# EasyEDA schematic SCH_HomeControl_2022-04-17.json
TITLE: Sheet_1; REV: 1.0; Date: 2022-04-16; Sheet: 1/1; Drawn By: Axfff; Company: Your Company
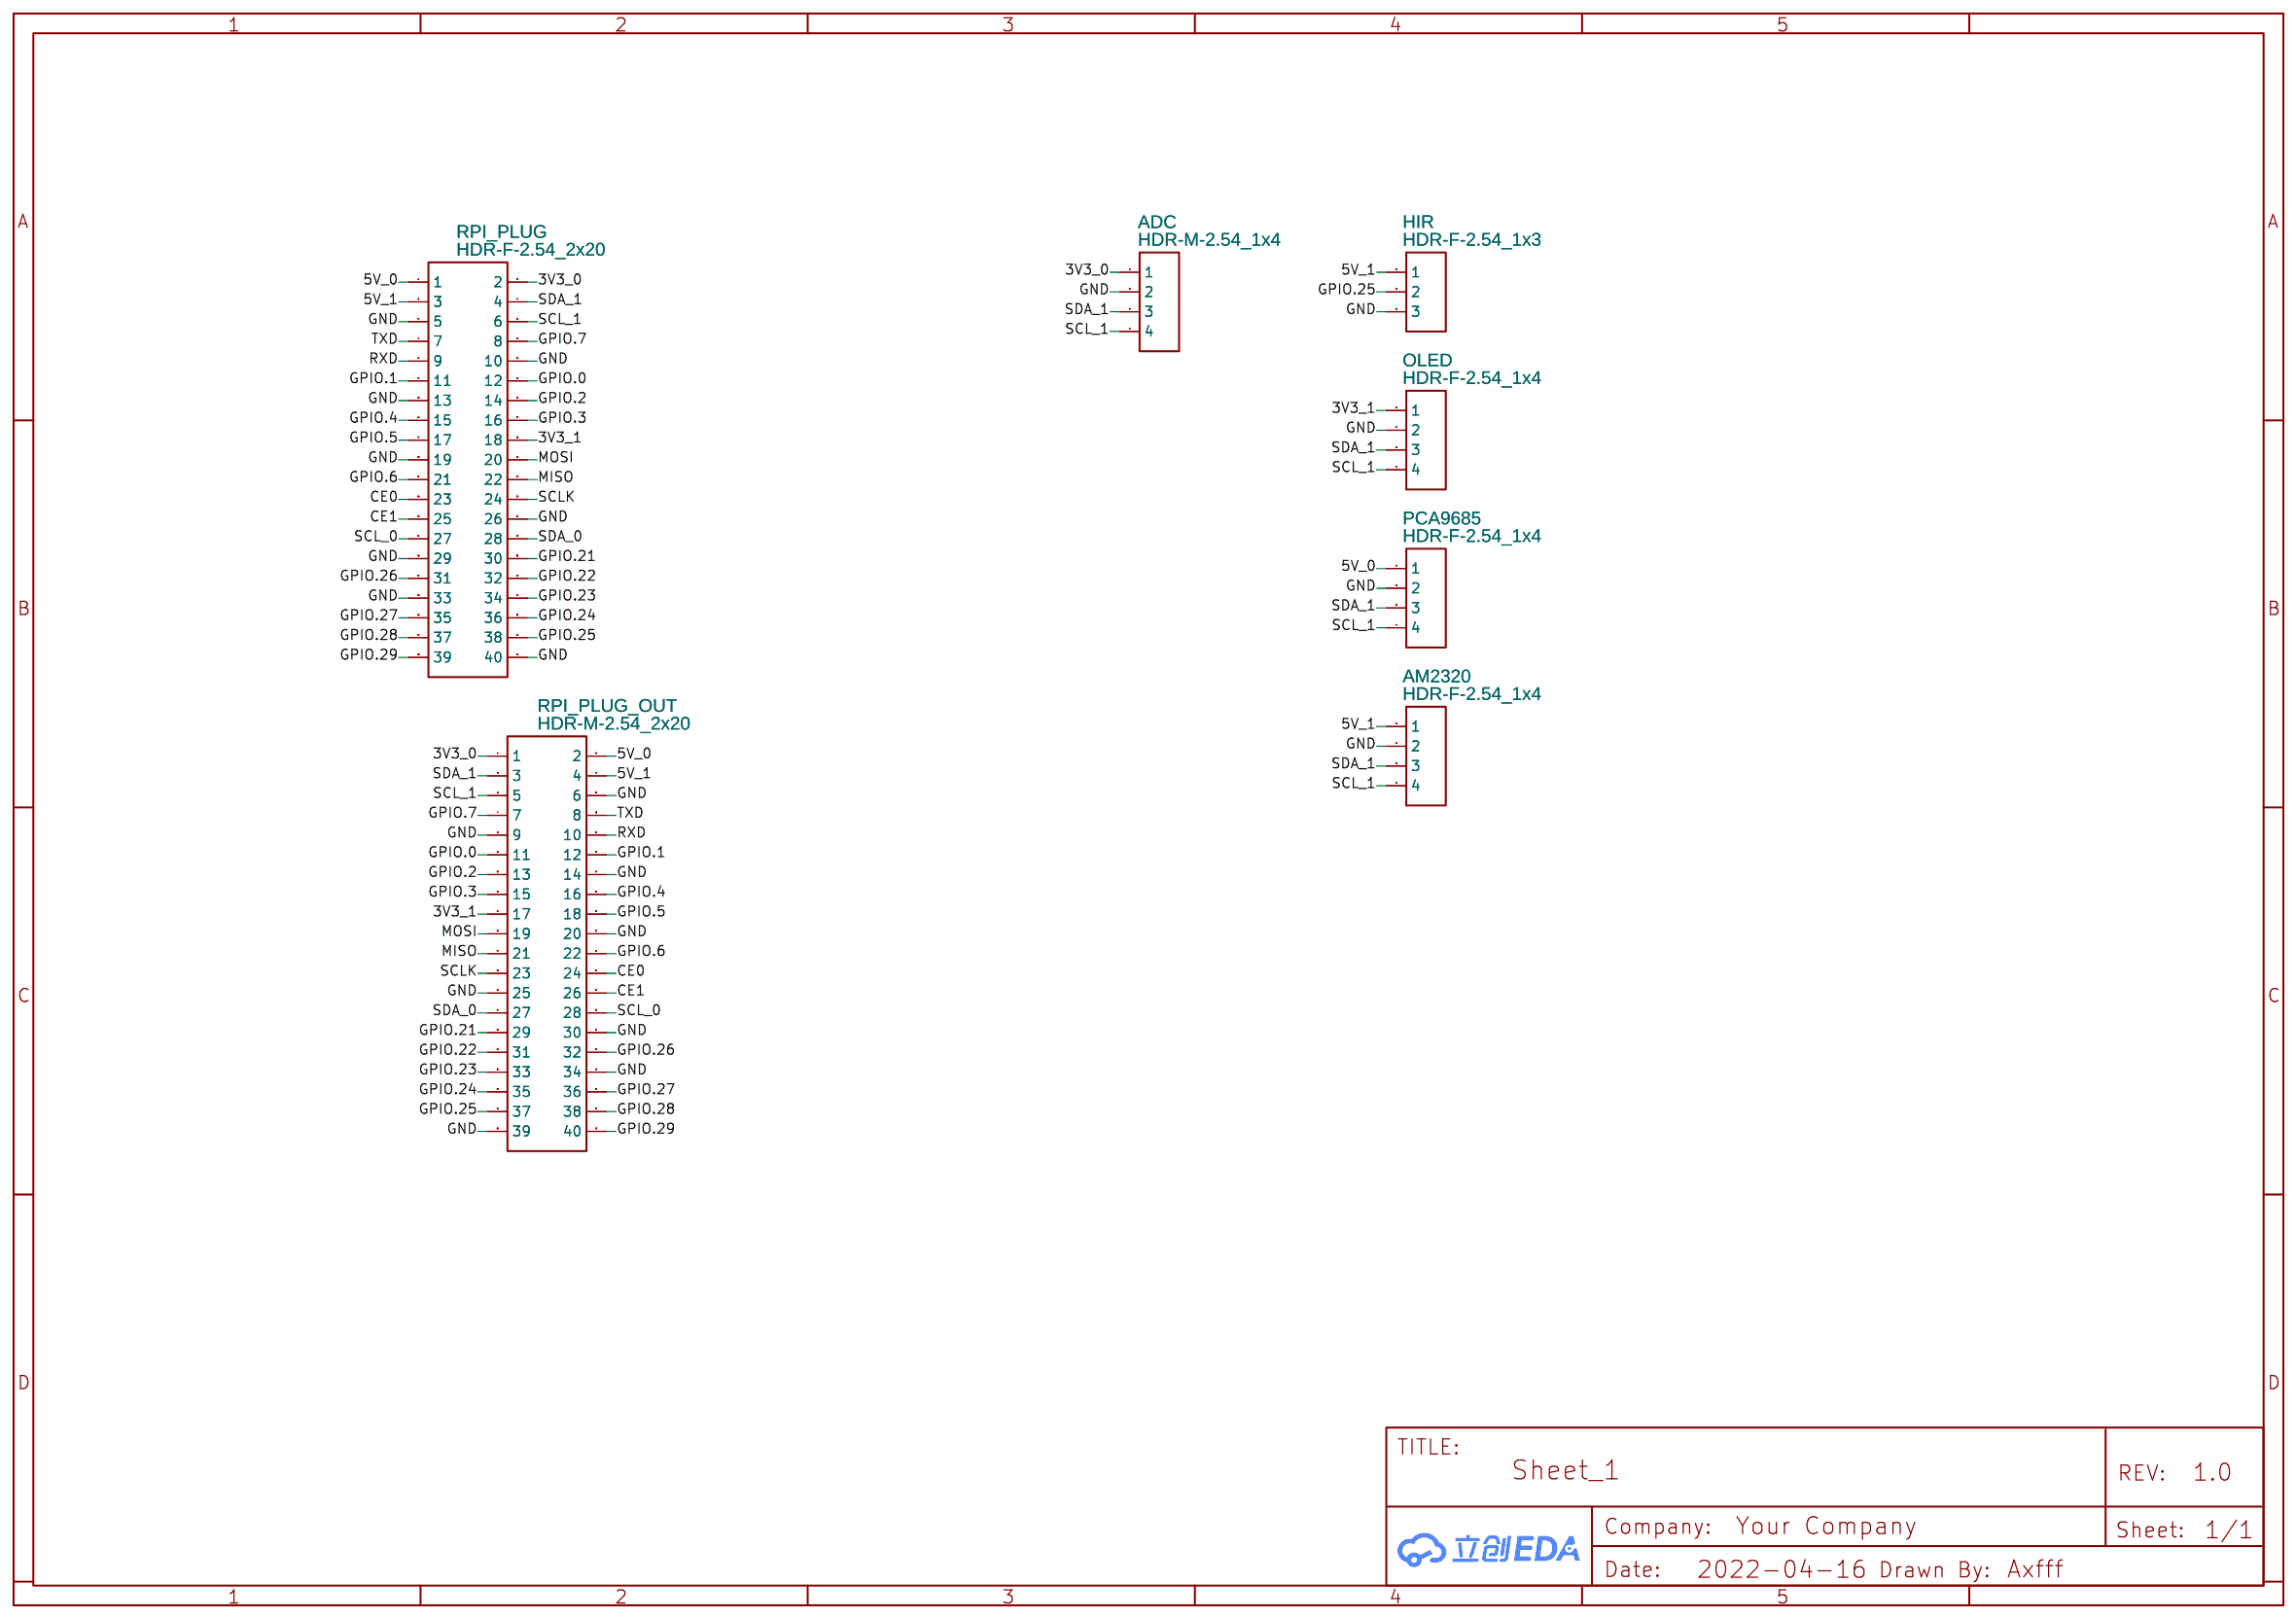
[diagram p0: schematic sheet]

## Parts
ADC  HDR-M-2.54_1x4  [HDR-M-2.54_1X4]
AM2320  HDR-F-2.54_1x4  [HDR-F-2.54_1X4]
HIR  HDR-F-2.54_1x3  [HDR-F-2.54_1X3]
OLED  HDR-F-2.54_1x4  [HDR-F-2.54_1X4]
PCA9685  HDR-F-2.54_1x4  [HDR-F-2.54_1X4]
RPI_PLUG  HDR-F-2.54_2x20  [HDR-F-2.54_2X20]
RPI_PLUG_OUT  HDR-M-2.54_2x20  [HDR-M-2.54_2X20]

## Library data of the parts
ADC = HDR-M-2.54_1x4: Supplier Part: C124378; Supplier: LCSC; Contributor: LCEDA_Lib
AM2320 OLED PCA9685 = HDR-F-2.54_1x4: Supplier Part: C225501; Supplier: LCSC; Contributor: LCEDA_Lib
HIR = HDR-F-2.54_1x3: Supplier Part: C146690; Supplier: LCSC; Contributor: LCEDA_Lib
RPI_PLUG = HDR-F-2.54_2x20: Supplier Part: C50982; Supplier: LCSC; Contributor: LCEDA_Lib
RPI_PLUG_OUT = HDR-M-2.54_2x20: Supplier Part: C50980; Supplier: LCSC; Contributor: LCEDA_Lib

## Nets
3V3_0: ADC.1 RPI_PLUG.2 RPI_PLUG_OUT.1
3V3_1: OLED.1 RPI_PLUG.18 RPI_PLUG_OUT.17
5V_0: PCA9685.1 RPI_PLUG.1 RPI_PLUG_OUT.2
5V_1: AM2320.1 HIR.1 RPI_PLUG.3 RPI_PLUG_OUT.4
GND: ADC.2 AM2320.2 HIR.3 OLED.2 PCA9685.2 RPI_PLUG.5 RPI_PLUG.10 RPI_PLUG.13 RPI_PLUG.19 RPI_PLUG.26 RPI_PLUG.29 RPI_PLUG.33 RPI_PLUG.40 RPI_PLUG_OUT.6 RPI_PLUG_OUT.9 RPI_PLUG_OUT.14 RPI_PLUG_OUT.20 RPI_PLUG_OUT.25 RPI_PLUG_OUT.30 RPI_PLUG_OUT.34 RPI_PLUG_OUT.39
CE0: RPI_PLUG.23 RPI_PLUG_OUT.24
CE1: RPI_PLUG.25 RPI_PLUG_OUT.26
GPIO.0: RPI_PLUG.12 RPI_PLUG_OUT.11
GPIO.1: RPI_PLUG.11 RPI_PLUG_OUT.12
GPIO.2: RPI_PLUG.14 RPI_PLUG_OUT.13
GPIO.3: RPI_PLUG.16 RPI_PLUG_OUT.15
GPIO.4: RPI_PLUG.15 RPI_PLUG_OUT.16
GPIO.5: RPI_PLUG.17 RPI_PLUG_OUT.18
GPIO.6: RPI_PLUG.21 RPI_PLUG_OUT.22
GPIO.7: RPI_PLUG.8 RPI_PLUG_OUT.7
GPIO.21: RPI_PLUG.30 RPI_PLUG_OUT.29
GPIO.22: RPI_PLUG.32 RPI_PLUG_OUT.31
GPIO.23: RPI_PLUG.34 RPI_PLUG_OUT.33
GPIO.24: RPI_PLUG.36 RPI_PLUG_OUT.35
GPIO.25: HIR.2 RPI_PLUG.38 RPI_PLUG_OUT.37
GPIO.26: RPI_PLUG.31 RPI_PLUG_OUT.32
GPIO.27: RPI_PLUG.35 RPI_PLUG_OUT.36
GPIO.28: RPI_PLUG.37 RPI_PLUG_OUT.38
GPIO.29: RPI_PLUG.39 RPI_PLUG_OUT.40
MISO: RPI_PLUG.22 RPI_PLUG_OUT.21
MOSI: RPI_PLUG.20 RPI_PLUG_OUT.19
RXD: RPI_PLUG.9 RPI_PLUG_OUT.10
SCL_0: RPI_PLUG.27 RPI_PLUG_OUT.28
SCL_1: ADC.4 AM2320.4 OLED.4 PCA9685.4 RPI_PLUG.6 RPI_PLUG_OUT.5
SCLK: RPI_PLUG.24 RPI_PLUG_OUT.23
SDA_0: RPI_PLUG.28 RPI_PLUG_OUT.27
SDA_1: ADC.3 AM2320.3 OLED.3 PCA9685.3 RPI_PLUG.4 RPI_PLUG_OUT.3
TXD: RPI_PLUG.7 RPI_PLUG_OUT.8
